# Altium schematic sheet REGULATEUR.SchDoc
size A
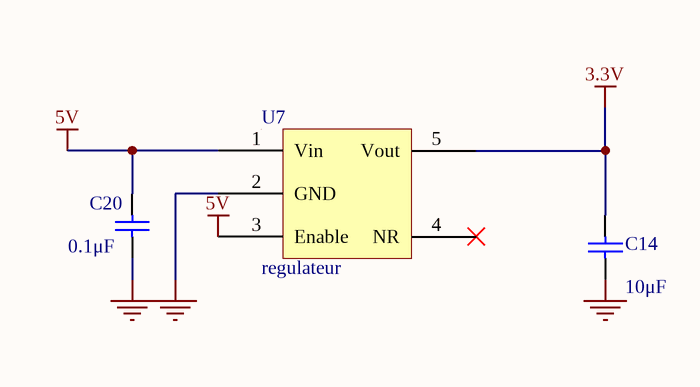
[diagram p0: REGULATEUR.SchDoc]

## Parts
C14  value 10μF  [cond]  (hidden comment: Cap)
C20  value 0.1μF  [cond]  (hidden comment: Cap)
U7  regulateur  [regulateur]

## Nets
3.3V: C14.2 U7.5(Vout)
5V: C20.2 U7.1(Vin) U7.3(Enable)
GND: C14.1 C20.1 U7.2(GND)

Not connected (* = marked no-connect by the designer): U7 4(NR)*

## Library data of the parts
C14 C20 = Cap: Capacitor; Published: 8-Jun-2000; LatestRevisionDate: 17-Jul-2002; LatestRevisionNote: Re-released for DXP Platform.; PackageReference: RAD-0.3; Publisher: Altium Limited; PackageDescription: Radial Cap, Thru-Hole; 2 Leads; 0.3 in Pin Spacing
U7 = regulateur: FABRIQUANT: TI; FOURNISSEUR: FARNELL; REF FABRIQUANT: REG102NA-3.3/250; REF FOURNISSEUR: 2323575